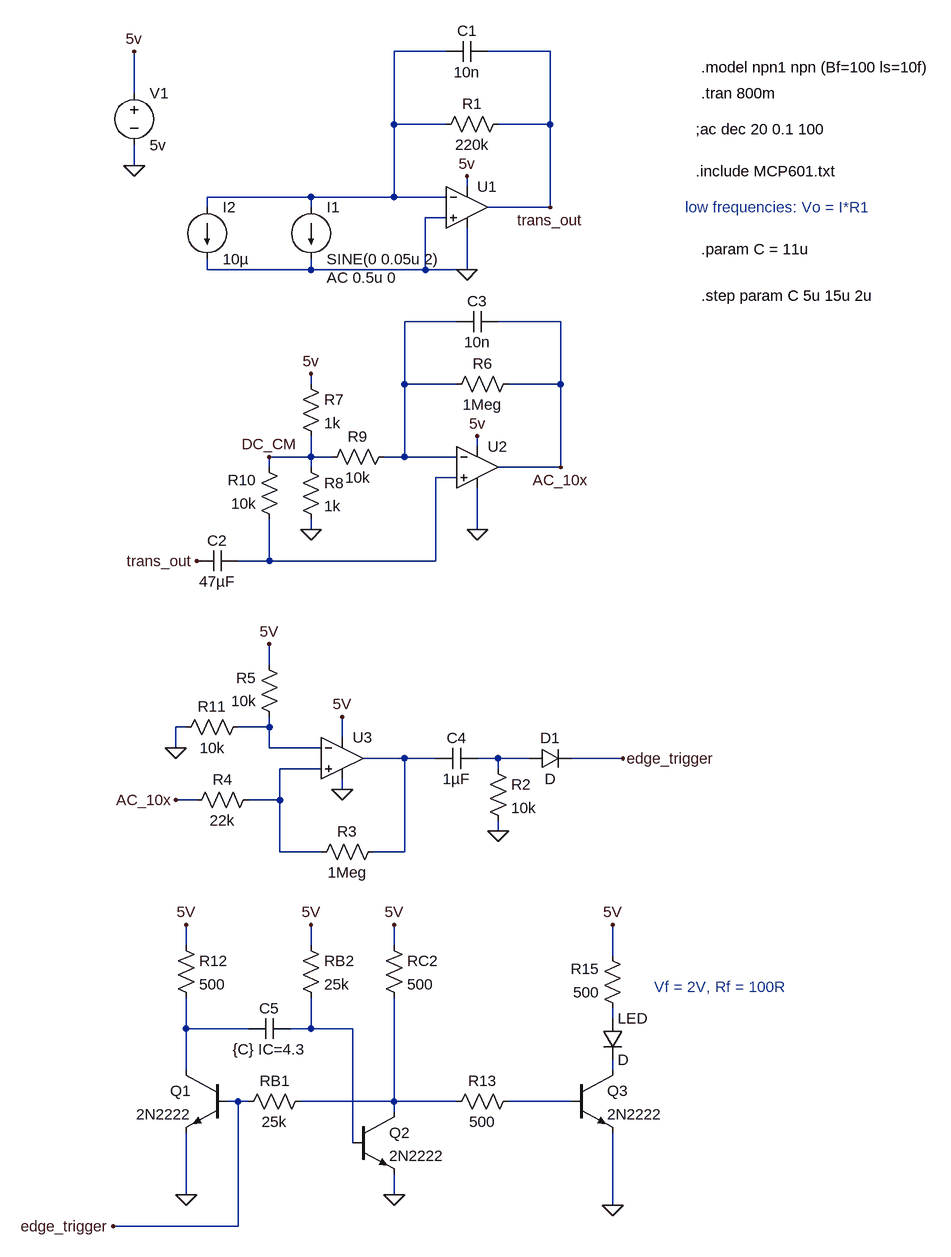
[diagram p0: schematic multivibrator_cap_sweep.asc]
multivibrator_cap_sweep.asc, the LTspice schematic file:
Version 4
SHEET 1 1648 1952
WIRE 16 -80 -64 -80
WIRE 176 -80 80 -80
WIRE -464 -16 -464 -80
WIRE -64 32 -64 -80
WIRE 16 32 -64 32
WIRE 176 32 176 -80
WIRE 176 32 96 32
WIRE -464 96 -464 64
WIRE 48 128 48 112
WIRE -192 144 -352 144
WIRE -64 144 -64 32
WIRE -64 144 -192 144
WIRE 16 144 -64 144
WIRE -352 160 -352 144
WIRE -192 160 -192 144
WIRE 176 160 176 32
WIRE 176 160 80 160
WIRE 16 176 -16 176
WIRE -352 256 -352 240
WIRE -192 256 -192 240
WIRE -192 256 -352 256
WIRE -16 256 -16 176
WIRE -16 256 -192 256
WIRE 48 256 48 192
WIRE 48 256 -16 256
WIRE 32 336 -48 336
WIRE 192 336 96 336
WIRE -192 432 -192 416
WIRE -48 432 -48 336
WIRE 32 432 -48 432
WIRE 192 432 192 336
WIRE 192 432 112 432
WIRE 64 528 64 512
WIRE -192 544 -192 512
WIRE -192 544 -256 544
WIRE -160 544 -192 544
WIRE -48 544 -48 432
WIRE -48 544 -80 544
WIRE 32 544 -48 544
WIRE -256 560 -256 544
WIRE -192 560 -192 544
WIRE 192 560 192 432
WIRE 192 560 96 560
WIRE 32 576 0 576
WIRE -192 656 -192 640
WIRE 64 656 64 592
WIRE -256 704 -256 640
WIRE -256 704 -304 704
WIRE 0 704 0 576
WIRE 0 704 -256 704
WIRE -256 864 -256 832
WIRE -384 960 -400 960
WIRE -256 960 -256 944
WIRE -256 960 -304 960
WIRE -144 976 -144 944
WIRE -400 992 -400 960
WIRE -256 992 -256 960
WIRE -176 992 -256 992
WIRE -48 1008 -112 1008
WIRE 0 1008 -48 1008
WIRE 96 1008 64 1008
WIRE 144 1008 96 1008
WIRE 288 1008 208 1008
WIRE -176 1024 -240 1024
WIRE 96 1024 96 1008
WIRE -144 1056 -144 1040
WIRE -368 1072 -400 1072
WIRE -240 1072 -240 1024
WIRE -240 1072 -288 1072
WIRE 96 1120 96 1104
WIRE -240 1152 -240 1072
WIRE -176 1152 -240 1152
WIRE -48 1152 -48 1008
WIRE -48 1152 -96 1152
WIRE -384 1296 -384 1264
WIRE -192 1296 -192 1264
WIRE -64 1296 -64 1264
WIRE 272 1312 272 1264
WIRE 272 1408 272 1392
WIRE -384 1424 -384 1376
WIRE -288 1424 -384 1424
WIRE -192 1424 -192 1376
WIRE -192 1424 -224 1424
WIRE -128 1424 -192 1424
WIRE -384 1488 -384 1424
WIRE 272 1488 272 1472
WIRE -304 1536 -320 1536
WIRE -288 1536 -304 1536
WIRE -64 1536 -64 1376
WIRE -64 1536 -208 1536
WIRE 32 1536 -64 1536
WIRE 208 1536 112 1536
WIRE -64 1552 -64 1536
WIRE -128 1600 -128 1424
WIRE -384 1680 -384 1584
WIRE -64 1680 -64 1648
WIRE 272 1696 272 1584
WIRE -304 1728 -304 1536
WIRE -304 1728 -496 1728
FLAG 48 256 0
FLAG 48 112 5v
FLAG -464 -80 5v
FLAG -464 96 0
FLAG 64 656 0
FLAG 64 512 5v
FLAG -192 416 5v
FLAG 176 160 trans_out
FLAG -192 656 0
FLAG -256 544 DC_CM
FLAG 192 560 AC_10x
FLAG -368 704 trans_out
FLAG 96 1120 0
FLAG 288 1008 edge_trigger
FLAG -144 1056 0
FLAG -144 944 5V
FLAG -400 992 0
FLAG -256 832 5V
FLAG -400 1072 AC_10x
FLAG -384 1264 5V
FLAG -64 1264 5V
FLAG -384 1680 0
FLAG -64 1680 0
FLAG 272 1696 0
FLAG -192 1264 5V
FLAG -496 1728 edge_trigger
FLAG 272 1264 5V
SYMBOL cap 80 -96 R90
WINDOW 0 0 32 VBottom 2
WINDOW 3 32 32 VTop 2
SYMATTR InstName C1
SYMATTR Value 10n
SYMBOL res 112 16 R90
WINDOW 0 0 56 VBottom 2
WINDOW 3 32 56 VTop 2
SYMATTR InstName R1
SYMATTR Value 220k
SYMBOL voltage -464 -32 R0
WINDOW 123 0 0 Left 2
WINDOW 39 0 0 Left 2
SYMATTR InstName V1
SYMATTR Value 5v
SYMBOL current -352 160 R0
WINDOW 123 0 0 Left 2
WINDOW 39 0 0 Left 2
SYMATTR InstName I2
SYMATTR Value 10µ
SYMBOL UniversalOpamp2 48 160 R0
SYMATTR InstName U1
SYMBOL res 128 416 R90
WINDOW 0 0 56 VBottom 2
WINDOW 3 32 56 VTop 2
SYMATTR InstName R6
SYMATTR Value 1Meg
SYMBOL UniversalOpamp2 64 560 R0
SYMATTR InstName U2
SYMBOL res -208 416 R0
SYMATTR InstName R7
SYMATTR Value 1k
SYMBOL res -208 544 R0
SYMATTR InstName R8
SYMATTR Value 1k
SYMBOL res -64 528 R90
WINDOW 0 0 56 VBottom 2
WINDOW 3 32 56 VTop 2
SYMATTR InstName R9
SYMATTR Value 10k
SYMBOL res -240 656 R180
WINDOW 0 36 76 Left 2
WINDOW 3 36 40 Left 2
SYMATTR InstName R10
SYMATTR Value 10k
SYMBOL cap -304 688 R90
WINDOW 0 0 32 VBottom 2
WINDOW 3 32 32 VTop 2
SYMATTR InstName C2
SYMATTR Value 47µF
SYMBOL current -192 160 R0
WINDOW 123 24 108 Left 2
WINDOW 39 0 0 Left 2
SYMATTR Value2 AC 0.5u 0
SYMATTR InstName I1
SYMATTR Value SINE(0 0.05u 2)
SYMBOL cap 96 320 R90
WINDOW 0 0 32 VBottom 2
WINDOW 3 32 32 VTop 2
SYMATTR InstName C3
SYMATTR Value 10n
SYMBOL cap 64 992 R90
WINDOW 0 0 32 VBottom 2
WINDOW 3 32 32 VTop 2
SYMATTR InstName C4
SYMATTR Value 1µF
SYMBOL res 80 1008 R0
SYMATTR InstName R2
SYMATTR Value 10k
SYMBOL diode 144 1024 R270
WINDOW 0 32 32 VTop 2
WINDOW 3 0 32 VBottom 2
SYMATTR InstName D1
SYMBOL UniversalOpamp2 -144 1008 R0
SYMATTR InstName U3
SYMBOL res -80 1136 R90
WINDOW 0 0 56 VBottom 2
WINDOW 3 32 56 VTop 2
SYMATTR InstName R3
SYMATTR Value 1Meg
SYMBOL res -272 1056 R90
WINDOW 0 0 56 VBottom 2
WINDOW 3 32 56 VTop 2
SYMATTR InstName R4
SYMATTR Value 22k
SYMBOL res -240 960 R180
WINDOW 0 36 76 Left 2
WINDOW 3 36 40 Left 2
SYMATTR InstName R5
SYMATTR Value 10k
SYMBOL res -400 976 R270
WINDOW 0 32 56 VTop 2
WINDOW 3 0 56 VBottom 2
SYMATTR InstName R11
SYMATTR Value 10k
SYMBOL npn -320 1488 M0
SYMATTR InstName Q1
SYMATTR Value 2N2222
SYMBOL npn -128 1552 R0
SYMATTR InstName Q2
SYMATTR Value 2N2222
SYMBOL npn 208 1488 R0
SYMATTR InstName Q3
SYMATTR Value 2N2222
SYMBOL cap -224 1408 R90
WINDOW 0 0 32 VBottom 2
WINDOW 3 32 32 VTop 2
SYMATTR InstName C5
SYMATTR Value {C} IC=4.3
SYMBOL res -400 1280 R0
SYMATTR InstName R12
SYMATTR Value 500
SYMBOL res -80 1280 R0
SYMATTR InstName RC2
SYMATTR Value 500
SYMBOL res 288 1408 R180
WINDOW 0 36 76 Left 2
WINDOW 3 36 40 Left 2
SYMATTR InstName R15
SYMATTR Value 500
SYMBOL res -192 1520 R90
WINDOW 0 0 56 VBottom 2
WINDOW 3 32 56 VTop 2
SYMATTR InstName RB1
SYMATTR Value 25k
SYMBOL res -208 1280 R0
SYMATTR InstName RB2
SYMATTR Value 25k
SYMBOL diode 256 1408 R0
SYMATTR InstName LED
SYMBOL res 128 1520 R90
WINDOW 0 0 56 VBottom 2
WINDOW 3 32 56 VTop 2
SYMATTR InstName R13
SYMATTR Value 500
TEXT 400 104 Left 2 !.include MCP601.txt
TEXT 384 160 Left 2 ;low frequencies: Vo = I*R1
TEXT 400 40 Left 2 !;ac dec 20 0.1 100
TEXT 408 -16 Left 2 !.tran 800m
TEXT 408 -56 Left 2 !.model npn1 npn (Bf=100 ls=10f)
TEXT 336 1360 Left 2 ;Vf = 2V, Rf = 100R
TEXT 408 224 Left 2 !.param C = 11u
TEXT 408 296 Left 2 !.step param C 5u 15u 2u

The netlist it stands for:
* multivibrator_cap_sweep.asc
C1 trans_out N001 10n
R1 trans_out N001 220k
V1 5v 0 5v
I2 N001 0 10µ
XU1 0 N001 5v 0 trans_out level.2 Avol=1Meg GBW=10Meg Slew=10Meg ilimit=25m rail=0 Vos=0 phimargin=45 en=0 enk=0 in=0 ink=0 Rin=500Meg  ; pins IN+ IN- V+ V- OUT
R6 AC_10x N002 1Meg
XU2 N003 N002 5v 0 AC_10x level.2 Avol=1Meg GBW=10Meg Slew=10Meg ilimit=25m rail=0 Vos=0 phimargin=45 en=0 enk=0 in=0 ink=0 Rin=500Meg  ; pins IN+ IN- V+ V- OUT
R7 5v DC_CM 1k
R8 DC_CM 0 1k
R9 N002 DC_CM 10k
R10 N003 DC_CM 10k
C2 N003 trans_out 47µF
I1 N001 0 SINE(0 0.05u 2) AC 0.5u 0
C3 AC_10x N002 10n
C4 N006 N005 1µF
R2 N006 0 10k
D1 N006 edge_trigger D
XU3 N007 N004 5v 0 N005 level.2 Avol=1Meg GBW=10Meg Slew=10Meg ilimit=25m rail=0 Vos=0 phimargin=45 en=0 enk=0 in=0 ink=0 Rin=500Meg  ; pins IN+ IN- V+ V- OUT
R3 N005 N007 1Meg
R4 N007 AC_10x 22k
R5 N004 5v 10k
R11 0 N004 10k
Q1 N009 edge_trigger 0 0 2N2222
Q2 N012 N010 0 0 2N2222
Q3 N011 N013 0 0 2N2222
C5 N010 N009 {C} IC=4.3
R12 5v N009 500
RC2 5v N012 500
R15 N008 5v 500
RB1 N012 edge_trigger 25k
RB2 5v N010 25k
D§LED N008 N011 D
R13 N013 N012 500
.model D D
.lib standard.dio
.model NPN NPN
.model PNP PNP
.lib standard.bjt
.include MCP601.txt
* low frequencies: Vo = I*R1
;ac dec 20 0.1 100
.tran 800m
.model npn1 npn (Bf=100 ls=10f)
* Vf = 2V, Rf = 100R
.param C = 11u
.step param C 5u 15u 2u
.lib UniversalOpamps2.sub
.backanno
.end